# Altium schematic sheet POWER.SchDoc
size A; SheetNumber: 3; SheetTotal: 3
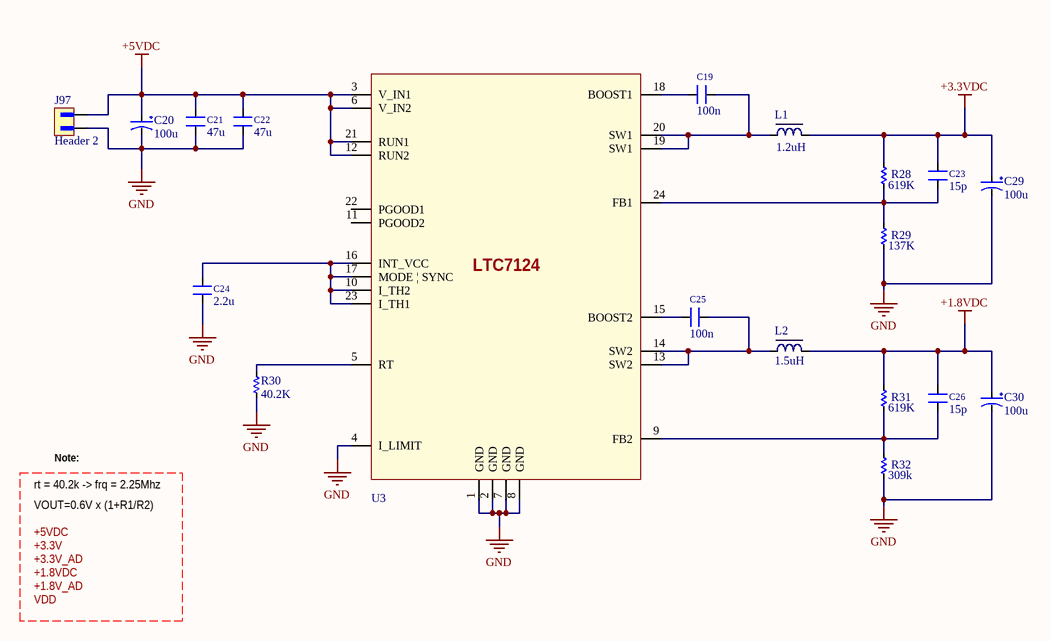
[diagram p0: POWER.SchDoc]

## Parts
C19  100n  [CN-SMD-0603]
C20  100u  [CAP-ALU-SMD-5x5.5x1.4]
C21  47u  [SM-CAP-3225]
C22  47u  [SM-CAP-3225]
C23  15p  [CN-SMD-0603]
C24  2.2u  [CN-SMD-0805]
C25  100n  [CN-SMD-0603]
C26  15p  [CN-SMD-0603]
C29  100u  [CAP-ALU-SMD-5x5.5x1.4]
C30  100u  [CAP-ALU-SMD-5x5.5x1.4]
J97  Header 2  [JST B2B-PH-SM4-TB (LF)(SN)]
L1  1.2uH  [L-SMD-06030-7.4x6.6X3]
L2  1.5uH  [L-SMD-06030-7.4x6.6X3]
R28  619K  [RES-SMD-0603]
R29  137K  [RES-SMD-0603]
R30  40.2K  [RES-SMD-0603]
R31  619K  [RES-SMD-0603]
R32  309k  [RES-SMD-0603]
U3  LTC7124  [24-Lead Plastic QFN (3mm × 5mm)]  (value not drawn)

## Nets
+1.8VDC: C26.1 C30.1 L2.2 R31.2
+3.3VDC: C23.1 C29.1 L1.2 R28.2
+5VDC: C20.1 C21.2 C22.2 J97.2 U3.3(V_IN1) U3.6(V_IN2) U3.12(RUN2) U3.21(RUN1)
GND: C20.2 C21.1 C22.1 C24.1 C29.2 C30.2 J97.1 R29.1 R30.1 R32.1 U3.1(GND) U3.2(GND) U3.4(I_LIMIT) U3.7(GND) U3.8(GND)
NetC19_1: C19.1 L1.1 U3.19(SW1) U3.20(SW1)
NetC19_2: C19.2 U3.18(BOOST1)
NetC23_2: C23.2 R28.1 R29.2 U3.24(FB1)
NetC24_2: C24.2 U3.10(I_TH2) U3.16(INT_VCC) U3.17(MODE_|_SYNC) U3.23(I_TH1)
NetC25_1: C25.1 L2.1 U3.13(SW2) U3.14(SW2)
NetC25_2: C25.2 U3.15(BOOST2)
NetC26_2: C26.2 R31.1 R32.2 U3.9(FB2)
NetR30_2: R30.2 U3.5(RT)

Not connected (* = marked no-connect by the designer): U3 11(PGOOD2) 22(PGOOD1)

## Notes on the sheet
- rt = 40.2k ->
- Note:
- frq = 2.25Mhz
- VOUT=0.6V x (1+R1/R2)
- +5VDC
- +3.3V
- +3.3V_AD
- +1.8VDC
- +1.8V_AD
- VDD

## Library data of the parts
C19 C21-C26 = CAP SMD: Value: 0,1uF/300V; Designed by: VanDungEvn
C20 C29 C30 = CAP-ALU-SMD: Published: 8-Jun-2000; LatestRevisionDate: 17-Jul-2002; LatestRevisionNote: Re-released for DXP Platform.; PackageReference: POLAR0.8; Publisher: Altium Limited
J97 = Header 2: Parameter 1: JST - GH - SMD (V) - 2Pin - 1.25mm; ComponentLink1Description: New link; ComponentLink1URL: C145937
L1 L2 = inductor-SMD: Value: 150 mH
R28-R32 = Res-SMD: Resistor; Manufacturer: Generic Components; Class: Passive; Published: 08/06/2000; Publisher: Altium Hobart Technology Centre
U3 = LTC7124: 17V, Dual 3.5A Synchronous Step-Down / Regulator with Ultralow Quiescent Current